# Altium schematic sheet CAN.SchDoc
size 420 x 297 mm; DocumentNumber: 9; SheetNumber: 10; SheetTotal: 17
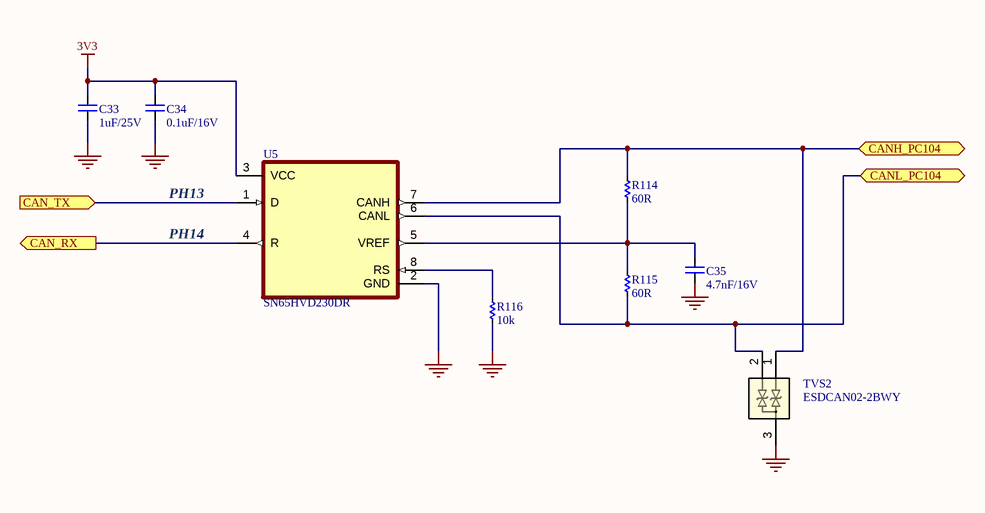
[diagram p0: CAN.SchDoc]

## Parts
C33  1uF/25V  [CAP_C_1608X80]
C34  0.1uF/16V  [CAP_C_1608X80]
C35  4.7nF/16V  [CAP_C_1608X80]
R114  60R  [RES_C_1608X60]
R115  60R  [RES_C_1608X60]
R116  10k  [RES_C_1608X60]
TVS2  ESDCAN02-2BWY  [SOT323-3L_STM]
U5  SN65HVD230DR  [SOIC127P599X175-8N]

## Ports
CAN_RX (out), CAN_TX (in), CANH_PC104 (bidir), CANL_PC104 (bidir)

## Nets
3V3: C33.1 C34.1 U5.3(VCC)
GND: C33.2 C34.2 C35.2 R116.1 TVS2.3 U5.2(GND)
CAN_RX: U5.4(R) ; port CAN_RX
CAN_TX: U5.1(D) ; port CAN_TX
CANH_PC104: R114.2 TVS2.1 U5.7(CANH) ; port CANH_PC104
CANL_PC104: R115.1 TVS2.2 U5.6(CANL) ; port CANL_PC104
NetC35_1: C35.1 R114.1 R115.2 U5.5(VREF)
NetR116_2: R116.2 U5.8(RS)

## Notes on the sheet
- PH13
- PH14
- Project:
- BEE-PC1
- Sub-system:
- NANORACK_EXP_CONTROLLER
- Design by:
- SANG HUYNH
- BAO BUI Q.
- Sheet title:
- Sheet
- A3
- of
- Checked by:
- Approved by:
- VU PHAM
- Revision:
- Document No:
- V1.2.2
- Size:
- Date:

## Library data of the parts
C33-C35 = CAP_SMD: CAP_Chip; Value: 33pF
R114-R116 = _RES_B_2: RES
TVS2 = ESDCAN02-2BWY: Automotive dual-line TVS in SOT323-3L for CAN bus (12 V system); Manufacturer_Name: STMicroelectronics; Copyright: Copyright (C) 2025 Ultra Librarian. All rights reserved.; Manufacturer_Part_Number: ESDCAN02-2BWY; RefDes: RefDes; Type: Type
U5 = SN65HVD230DR: 3.3 V CAN Transceiver with Standby Mode; MF: Texas Instruments; SnapEDA_Link: https://www.snapeda.com/parts/SN65HVD230DR/Texas+Instruments/view-part/?ref=snap; Package: SOIC-8 Texas Instruments; Value: *; MP: SN65HVD230DR; Check_prices: https://www.snapeda.com/parts/SN65HVD230DR/Texas+Instruments/view-part/?ref=eda